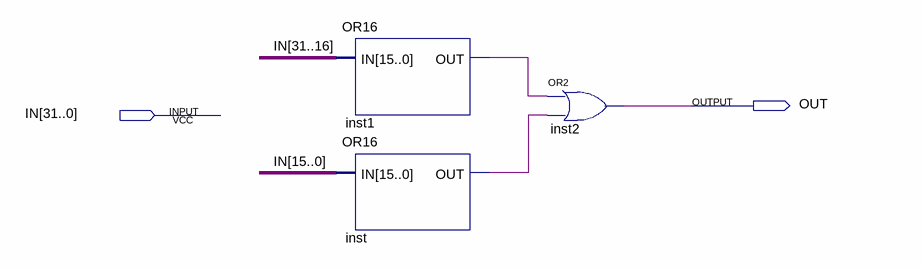
[diagram p0: schematic sheet]
// Quartus schematic OR32.bdf as structural Verilog: 3 symbols, 2 pins
module OR32 (
  input  [31:0] IN,
  output OUT
);

  wire inst1_out, inst_out;

  OR16 inst1 (.IN(IN[31:16]), .OUT(inst1_out));
  OR16 inst (.IN(IN[15:0]), .OUT(inst_out));
  or inst2 (OUT, inst1_out, inst_out);
endmodule
